# Altium schematic sheet FunskjonsBlokkskjema.SchDoc
size A3
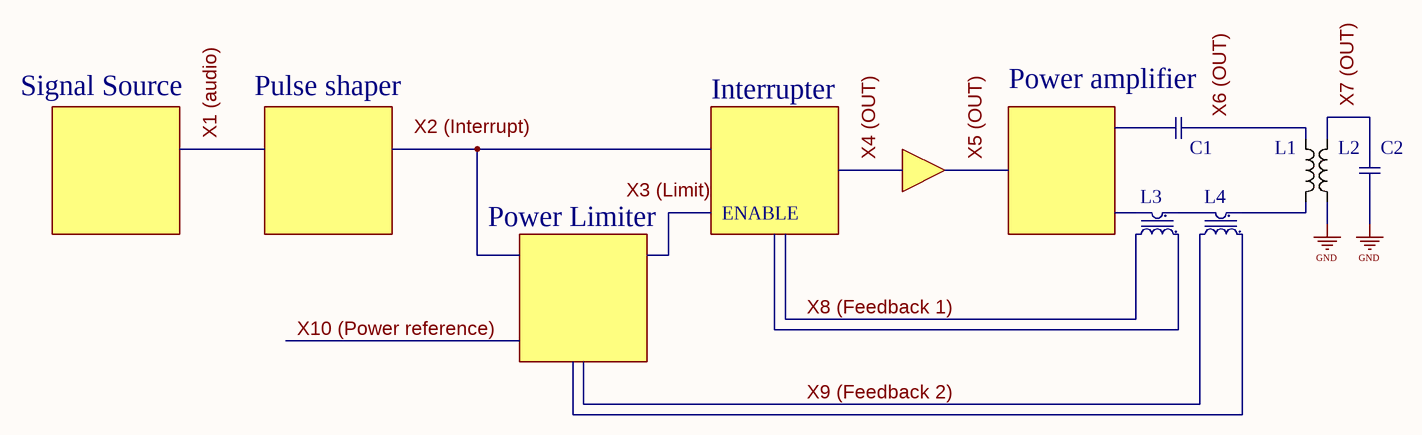
[diagram p0: FunskjonsBlokkskjema.SchDoc]

## Parts
C1  100nF  [CAPC0603(1608)55_N]  (value not drawn)
C2  100nF  [CAPC0603(1608)55_N]  (value not drawn)
L1  SMD spoler  [INDP3225X20N]  (value not drawn)
L2  SMD spoler  [INDP3225X20N]  (value not drawn)
L3  CurrentSenseTransformer  (value not drawn)
L4  CurrentSenseTransformer  (value not drawn)

## Nets
GND: C2.2 L2.1
X8 (Feedback 1): L3.3
X9 (Feedback 2): L4.3
NetC1_1: C1.1 L1.1
NetC2_1: C2.1 L2.2
NetL1_2: L1.2 L4.2
NetL3_2: L3.2 L4.1

Not connected (* = marked no-connect by the designer): C1 2; L3 1 4; L4 4

## Notes on the sheet
- Signal Source
- Pulse shaper
- Interrupter
- (near C1) Power amplifier
- ENABLE
- Power Limiter
- Labels drawn without touching a wire or pin: X1 (audio), X2 (Interrupt), X3 (Limit), X4 (OUT), X5 (OUT), X6 (OUT), X7 (OUT)
- Size:
- Date:
- Title:
- A3
- Revision:
- Sheet
- of
- Author:
- File:

## Library data of the parts
C1 C2 = 3028: X7R 50V 5%; id: 3028; pakke_opprettet_av: 815; pakke_opprettet: 18.02.2015 14.18.13; symbol_opprettet: 14.11.2014 20.19.34; leverandor_varenr: 1759122; pris: 1; nokkelord: Kondensator, Capacitor, CAP; produsent: Multikomp; leverandor: Farnell; pakketype: 0603; symbol_opprettet_av: 815; navn: 100nF
L1 L2 = 1739: SMD inductors og tomme SMD bokser; id: 1739; pakke_opprettet_av: 924; pakke_opprettet: 26.05.2015 23.51.10; symbol_opprettet: 27.05.2015 00.20.21; pris: -1; symbol_opprettet_av: 924; navn: SMD spoler; pakketype: SMD
L3 L4 = 3771: id: 3771; symbol_opprettet_av: 815; symbol_opprettet: 29.09.2016 16.19.11; pris: 100; produsent: OV; navn: CurrentSenseTransformer; pakketype: -